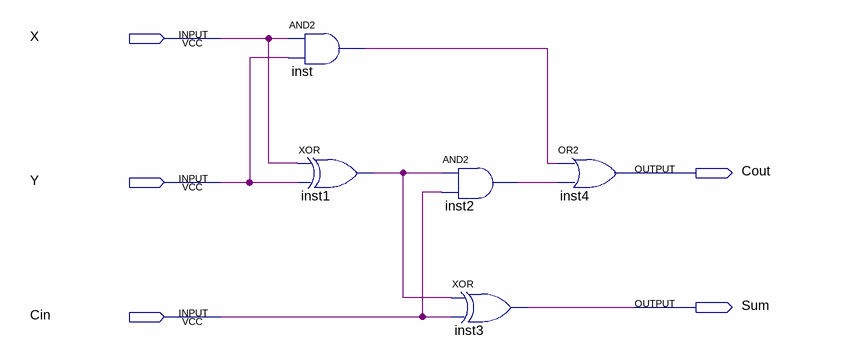
[diagram p0: schematic sheet]
// Quartus schematic fulladder.bdf as structural Verilog: 5 symbols, 5 pins
module fulladder (
  input  X,
  input  Y,
  input  Cin,
  output Cout,
  output Sum
);

  wire inst1_out, inst2_out, inst_out;

  and inst (inst_out, X, Y);
  xor inst1 (inst1_out, X, Y);
  and inst2 (inst2_out, inst1_out, Cin);
  xor inst3 (Sum, inst1_out, Cin);
  or inst4 (Cout, inst_out, inst2_out);
endmodule
